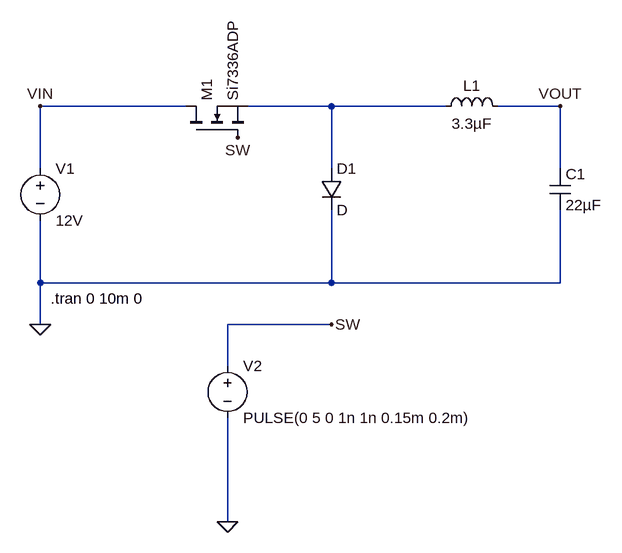
[diagram p0: schematic BUCK CONVERTOR.asc]
BUCK CONVERTOR.asc, the LTspice schematic file:
Version 4.1
SHEET 1 972 680
WIRE -128 -96 -352 -96
WIRE 96 -96 -32 -96
WIRE 272 -96 96 -96
WIRE 448 -96 352 -96
WIRE -352 0 -352 -96
WIRE 96 0 96 -96
WIRE 448 0 448 -96
WIRE -352 176 -352 80
WIRE 96 176 96 64
WIRE 96 176 -352 176
WIRE 448 176 448 64
WIRE 448 176 96 176
WIRE -352 240 -352 176
WIRE 96 240 -64 240
WIRE -64 304 -64 240
WIRE -64 544 -64 384
FLAG -352 -96 VIN
FLAG 448 -96 VOUT
FLAG -48 -48 SW
FLAG -64 544 0
FLAG 96 240 SW
FLAG -352 240 0
SYMBOL nmos -128 -48 R270
SYMATTR InstName M1
SYMATTR Value Si7336ADP
SYMBOL ind 256 -80 R270
WINDOW 0 32 56 VTop 2
WINDOW 3 5 56 VBottom 2
SYMATTR InstName L1
SYMATTR Value 3.3µF
SYMBOL cap 432 0 R0
SYMATTR InstName C1
SYMATTR Value 22µF
SYMBOL voltage -352 -16 R0
WINDOW 123 0 0 Left 0
WINDOW 39 0 0 Left 0
SYMATTR InstName V1
SYMATTR Value 12V
SYMBOL diode 80 0 R0
SYMATTR InstName D1
SYMBOL voltage -64 288 R0
WINDOW 123 0 0 Left 0
WINDOW 39 0 0 Left 0
SYMATTR InstName V2
SYMATTR Value PULSE(0 5 0 1n 1n 0.15m 0.2m)
TEXT -336 200 Left 2 !.tran 0 10m 0

The netlist it stands for:
* BUCK CONVERTOR.asc
M1 VIN SW N001 N001 Si7336ADP
L1 N001 VOUT 3.3µF
C1 VOUT 0 22µF
V1 VIN 0 12V
D1 N001 0 D
V2 SW 0 PULSE(0 5 0 1n 1n 0.15m 0.2m)
.model D D
.lib standard.dio
.model NMOS NMOS
.model PMOS PMOS
.lib standard.mos
.tran 0 10m 0
.backanno
.end